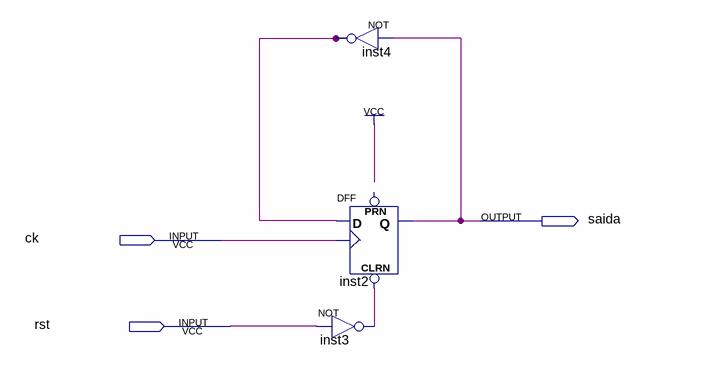
[diagram p0: schematic sheet]
// Quartus schematic div_freq_1bit.bdf as structural Verilog: 3 symbols, 3 pins
module div_freq_1bit (
  input  ck,
  input  rst,
  output saida
);

  wire inst3_out, inst4_out;

  not inst3 (inst3_out, rst);
  not inst4 (inst4_out, saida);
  DFF inst2 (.CLRN(inst3_out), .CLK(ck), .D(inst4_out), .Q(saida));  // open: PRN
endmodule
